# EAGLE design Tape_V2 (EAGLE 9.6.2)
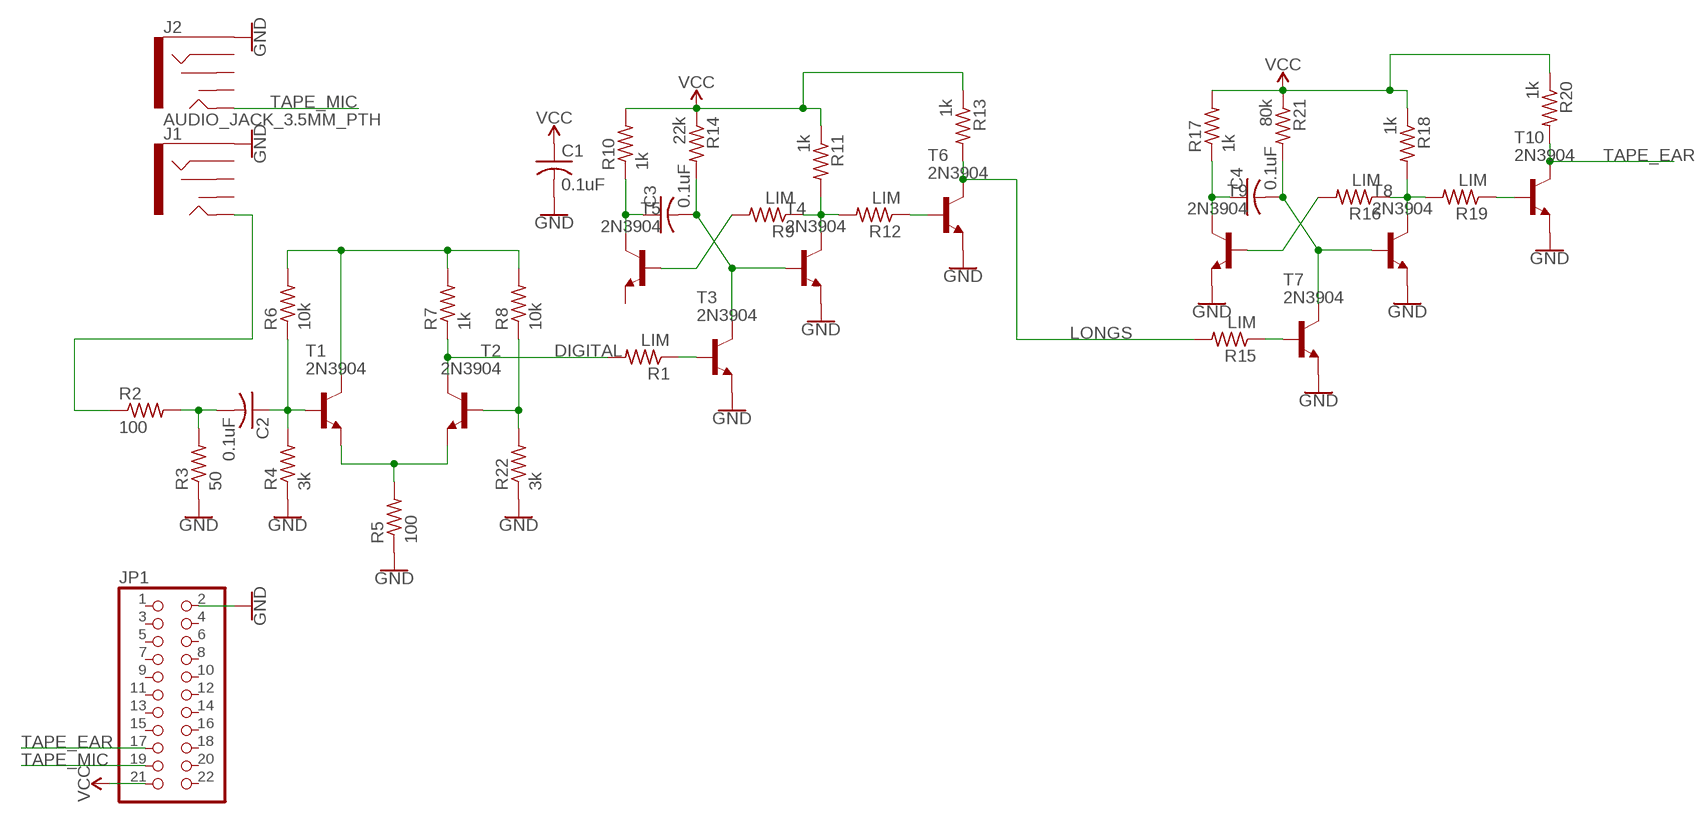
[diagram p0: schematic, sheet 1]

## Parts
C1  0.1uF  C-US025-030X050  [C025-030X050]
C2  0.1uF  C-US025-030X050  [C025-030X050]
C3  0.1uF  C-US025-030X050  [C025-030X050]
C4  0.1uF  C-US025-030X050  [C025-030X050]
J1  AUDIO_JACK_3.5MM_PTH  [AUDIO-JACK]
J2  AUDIO_JACK_3.5MM_PTH  [AUDIO-JACK]
JP1  PINHD-2X11/90  [2X11/90]
R1  LIM  R-US_0204/7  [0204/7]
R2  100  R-US_0204/7  [0204/7]
R3  50  R-US_0204/7  [0204/7]
R4  3k  R-US_0204/7  [0204/7]
R5  100  R-US_0204/7  [0204/7]
R6  10k  R-US_0204/7  [0204/7]
R7  1k  R-US_0204/7  [0204/7]
R8  10k  R-US_0204/7  [0204/7]
R9  LIM  R-US_0204/7  [0204/7]
R10  1k  R-US_0204/7  [0204/7]
R11  1k  R-US_0204/7  [0204/7]
R12  LIM  R-US_0204/7  [0204/7]
R13  1k  R-US_0204/7  [0204/7]
R14  22k  R-US_0204/7  [0204/7]
R15  LIM  R-US_0204/7  [0204/7]
R16  LIM  R-US_0204/7  [0204/7]
R17  1k  R-US_0204/7  [0204/7]
R18  1k  R-US_0204/7  [0204/7]
R19  LIM  R-US_0204/7  [0204/7]
R20  1k  R-US_0204/7  [0204/7]
R21  80k  R-US_0204/7  [0204/7]
R22  3k  R-US_0204/7  [0204/7]
T1  2N3904  [TO92]
T2  2N3904  [TO92]
T3  2N3904  [TO92]
T4  2N3904  [TO92]
T5  2N3904  [TO92]
T6  2N3904  [TO92]
T7  2N3904  [TO92]
T8  2N3904  [TO92]
T9  2N3904  [TO92]
T10  2N3904  [TO92]

## Nets
DIGITAL: R1.2 R7.1 T2.1(C)
GND: C1.2 J1.SLEEVE J2.SLEEVE JP1.2 R3.1 R4.1 R5.1 R22.1 T3.3(E) T4.3(E) T6.3(E) T7.3(E) T8.3(E) T9.3(E) T10.3(E)
LONGS: R13.2 R15.2 T6.1(C)
N$1: R5.2 T1.3(E) T2.3(E)
N$2: C2.1 R4.2 R6.1 T1.2(B)
N$3: C2.2 R2.2 R3.2
N$4: R6.2 R7.2 R8.2 T1.1(C)
N$5: R1.1 T3.2(B)
N$6: R8.1 R22.2 T2.2(B)
N$7: J1.TIP R2.1
N$8: C3.2 R14.2 T3.1(C) T4.2(B)
N$9: R9.2 T5.2(B)
N$10: C3.1 R10.1 T5.1(C)
N$12: R9.1 R11.2 R12.2 T4.1(C)
N$13: R12.1 T6.2(B)
N$16: R15.1 T7.2(B)
N$17: C4.2 R21.2 T7.1(C) T8.2(B)
N$18: R16.2 T9.2(B)
N$19: C4.1 R17.1 T9.1(C)
N$20: R16.1 R18.2 R19.2 T8.1(C)
N$21: R19.1 T10.2(B)
TAPE_EAR: JP1.17 R20.2 T10.1(C)
TAPE_MIC: J2.TIP JP1.19
VCC: C1.1 JP1.21 R10.2 R11.1 R13.1 R14.1 R17.2 R18.1 R20.1 R21.1
Unconnected: J1.RING J1.RSH J1.TSH J2.RING J2.RSH J2.TSH JP1.1 JP1.3 JP1.4 JP1.5 JP1.6 JP1.7 JP1.8 JP1.9 JP1.10 JP1.11 JP1.12 JP1.13 JP1.14 JP1.15 JP1.16 JP1.18 JP1.20 JP1.22 T5.3(E)

## Library data of the parts
C1-C4 = adafruit:C-US: CAPACITOR, American symbol
J1 J2 = SparkFun-Connectors:AUDIO_JACK_3.5MM: Audio Jack 3.5mm variants of PTH and SMT stereo audio jack with bypass switches. SparkFun Products: SparkFun SparkPunk Sound Kit <[https://www.sparkfun.com/products/11177]> - PTH MP3 Trigger <https://www.sparkfun.com/products/13720> -3.5mm SMD SparkFun PicoBoard <https://www.sparkfun.com/products/11888>- 2.5mm SMD; PROD_ID: CONN-08774; SF_ID: PRT-08032
JP1 = pinhead:PINHD-2X11: PIN HEADER
R1-R22 = adafruit:R-US_: RESISTOR, American symbol
T1-T10 = transistor:2N3904: NPN TRANSISTOR

## Board
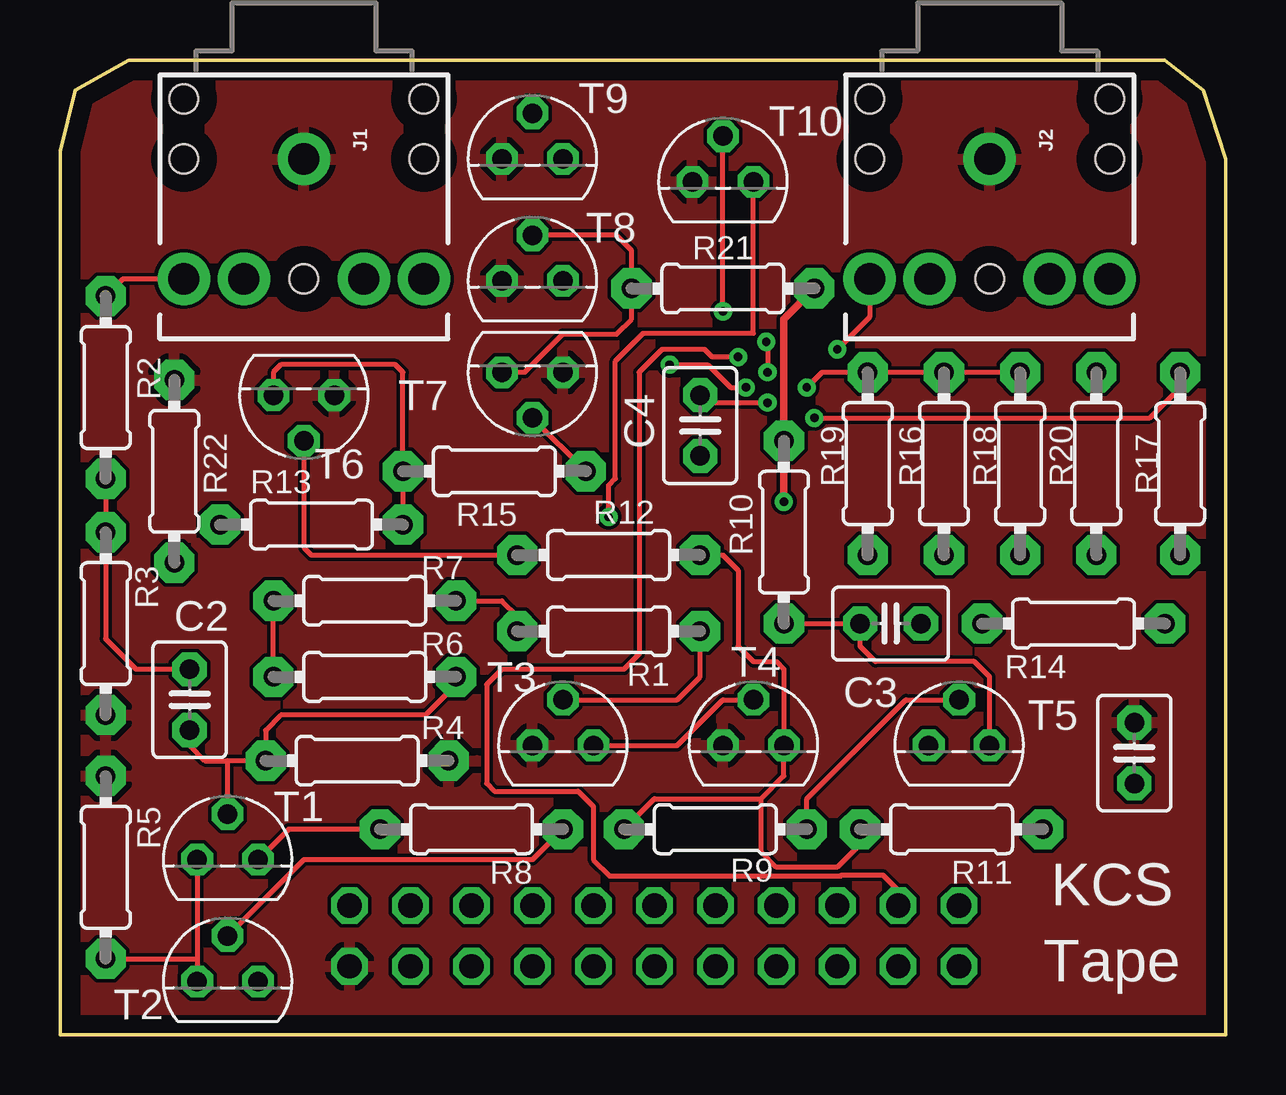
[diagram p1: board, top side]
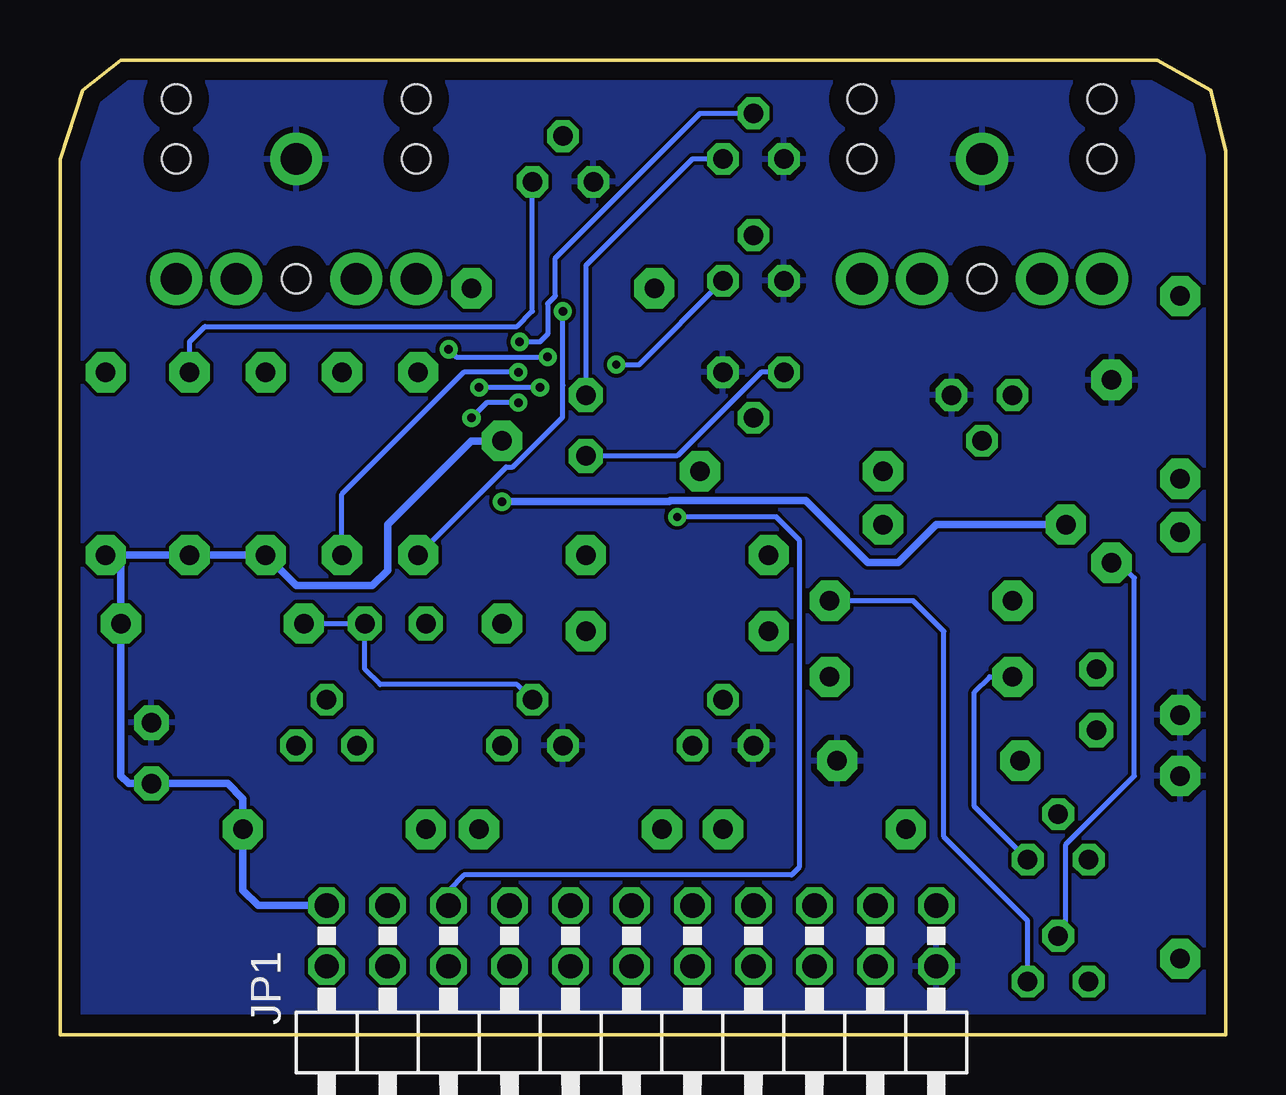
[diagram p2: board, bottom side, seen from below]

Size 48.58 x 40.64 mm. Coordinates in mm from the lower left corner, seen from the top.
Outline: 0.64,39.37 2.86,40.64 46.04,40.64 47.62,39.37 48.58,36.51 48.58,0 0,0 0,36.83 0.64,39.37
Copper layers (1*16): Top 0.035mm / dielectric 1.5mm / Bottom 0.035mm
Design rules "default *": minimum track width 8mil, minimum drill 0.35mm, track to track 6mil, track to pad 6mil, pad to pad 6mil, via to via 6mil, smd to smd 6mil, copper to edge 30mil, drill to drill 6mil, minimum pad ring 10mil, minimum via ring 8mil, stop-mask expansion 4mil, vias tented up to drill 0mil, thermal gap 10mil

### Footprints (pad centres in the part's own frame; a part is rotated, then mirrored left to right if it is on the bottom)
C025-030X050 = drill 0.813 pad 1.422 octagon: 1 -1.27,0; 2 1.27,0
AUDIO-JACK = drill 1.3 pad 2.184: RING 5,5; RSH 5,2.5; SLEEVE 0,0; TIP 5,-5; TSH 5,-2.5 | hole 1.2: 0,5; -2.5,5; -2.5,-5; 0,-5; 5,0
2X11/90 = drill 1.016 octagon: 1 -12.7,-6.35; 2 -12.7,-3.81; 3 -10.16,-6.35; 4 -10.16,-3.81; 5 -7.62,-6.35; 6 -7.62,-3.81; 7 -5.08,-6.35; 8 -5.08,-3.81; 9 -2.54,-6.35; 10 -2.54,-3.81; 11 0,-6.35; 12 0,-3.81; 13 2.54,-6.35; 14 2.54,-3.81; 15 5.08,-6.35; 16 5.08,-3.81; 17 7.62,-6.35; 18 7.62,-3.81; 19 10.16,-6.35; 20 10.16,-3.81; 21 12.7,-6.35; 22 12.7,-3.81
0204/7 = drill 0.813 pad 1.676 octagon: 1 -3.81,0; 2 3.81,0
TO92 = drill 0.813 octagon: 1 1.27,0; 2 0,1.905; 3 -1.27,0

### Placement (x,y rotation side)
C1  44.77,11.75 90 top
C2  5.4,13.97 90 top
C3  34.61,17.14 0 top
C4  26.67,25.4 270 top
J1  10.16,36.51 270 top
J2  38.73,36.51 270 top
JP1  24.77,-0.95 180 bottom
R1  22.86,16.83 180 top
R2  1.9,26.99 270 top
R3  1.9,17.14 90 top
R4  12.38,11.43 180 top
R5  1.9,6.98 270 top
R6  12.7,14.92 180 top
R7  12.7,18.1 180 top
R8  17.14,8.57 180 top
R9  27.3,8.57 0 top
R10  30.16,20.96 90 top
R11  37.15,8.57 180 top
R12  22.86,20 0 top
R13  10.48,21.27 0 top
R14  42.23,17.14 180 top
R15  18.1,23.5 180 top
R16  36.83,23.81 270 top
R17  46.67,23.81 270 top
R18  40.01,23.81 90 top
R19  33.66,23.81 90 top
R20  43.18,23.81 90 top
R21  27.62,31.12 180 top
R22  4.76,23.5 270 top
T1  6.98,7.3 0 top
T2  6.98,2.22 0 top
T3  20.96,12.06 0 top
T4  28.89,12.06 0 top
T5  37.47,12.06 0 top
T6  10.16,26.67 180 top
T7  19.68,27.62 180 top
T8  19.68,31.43 0 top
T9  19.68,36.51 0 top
T10  27.62,35.56 0 top

### Tracks (layer width: path | path; a pad name or v marks a point on that pad's centre or on a via)
DIGITAL
  Top 0.203: R7.1 18.41,18.1 19.05,17.46 R1.2
  Bottom 0.203: T2.1 8.26,4.76 11.75,8.26 11.75,16.83 13.02,18.1 R7.1
GND
  pour Top: -1.91,41.27 -1.91,-1.27 49.21,-1.27 49.21,41.27
  pour Bottom: -2.22,41.91 -2.22,-1.59 49.21,-1.59 49.53,-1.91 49.53,42.23 -1.91,42.23
LONGS
  Top 0.203: R13.2 R15.2 14.29,27.62 13.97,27.94 9.21,27.94 8.89,27.62 T6.1
N$1
  Top 0.203: T1.3 5.71,3.18 | 5.71,3.18 T2.3 | R5.2 5.71,3.18
N$2
  Top 0.203: 6.98,11.43 R4.2 8.57,12.7 9.21,13.34 15.24,13.34 16.51,14.61 R6.1 | T1.2 6.98,11.43 | 6.98,11.43 6.03,11.43 5.4,12.06 C2.1
N$3
  Top 0.203: R2.2 R3.2 1.9,16.51 3.18,15.24 C2.2
N$4
  Top 0.203: R6.2 R7.2 | R8.2 9.53,8.57 T1.1
  Bottom 0.203: T1.1 10.48,9.53 10.48,14.29 9.84,14.92 R6.2
N$5
  Top 0.203: T3.2 25.72,13.97 26.67,14.92 R1.1
N$6
  Top 0.203: R8.1 19.68,7.3 10.16,7.3 T2.2
  Bottom 0.203: T2.2 6.67,4.45 6.67,7.94 3.81,10.79 3.81,19.05 4.45,19.68 R22.2
N$7
  Top 0.203: J1.TIP 2.62,31.51 R2.1
N$8
  Top 0.203: T3.1 25.72,12.06 27.62,13.97 T4.2
  Bottom 0.203: T4.2 29.53,14.61 35.24,14.61 35.88,15.24 C3.2 R14.2
N$9
  Top 0.203: R9.2 31.12,9.84 35.24,13.97 T5.2
N$10
  Top 0.203: T5.1 38.73,14.92 38.1,15.56 33.97,15.56 33.34,16.19 C3.1 R10.1
N$12
  Top 0.203: R9.1 24.77,9.84 29.21,9.84 | 29.21,9.84 30.16,10.79 T4.1 30.16,15.24 29.84,15.56 28.89,15.56 28.26,16.19 28.26,19.37 27.62,20 R12.2 | R11.2 33.34,7.94 32.38,6.98 29.84,6.98 29.21,7.62 29.21,9.84
N$13
  Top 0.203: T6.2 10.16,20.32 10.48,20 R12.1
N$16
  Top 0.203: T7.2 R15.1
N$17
  Top 0.203: T7.1 19.37,27.62 20.96,29.21 23.18,29.21 23.81,29.84 R21.2 23.81,32.7 23.18,33.34 T8.2
  Bottom 0.203: T7.1 19.37,27.62 22.86,24.13 C4.2
N$18  (via drill 0.35)
  Top 0.203: v29.43,28.89 29.48,28.84 v29.48,27.62
  Bottom 0.203: R16.2 36.83,22.54 31.75,27.62 v29.48,27.62 | T9.2 21.91,38.42 27.94,32.38 27.94,30.8 28.26,30.48 28.26,29.21 28.58,28.89 v29.43,28.89
N$19  (via drill 0.35)
  Top 0.203: R17.1 46.67,26.99 45.4,25.72 v31.43,25.72 | C4.1 26.99,26.35 v29.48,26.35
  Bottom 0.203: T9.1 22.23,36.51 26.67,32.07 C4.1 | v29.48,26.35 30.8,26.35 v31.43,25.72
N$20  (via drill 0.35)
  Top 0.203: v25.4,27.94 26.99,27.94 27.94,26.99 v28.58,26.99 | R16.1 R18.2 R19.2 31.75,27.62 v31.12,26.99
  Bottom 0.203: v25.4,27.94 24.45,27.94 T8.1 | v28.58,26.99 v31.12,26.99
N$21  (via drill 0.35)
  Top 0.203: v27.62,30.16 T10.2
  Bottom 0.203: R19.1 29.98,23.67 29.71,23.67 27.64,25.75 27.64,27.07 27.62,27.08 v27.62,30.16
TAPE_EAR  (via drill 0.35)
  Top 0.203: v22.86,21.59 22.86,22.9 23.14,23.18 23.14,28.09 24.3,29.25 28.89,29.25 T10.1
  Bottom 0.203: R20.2 43.18,28.89 42.55,29.53 29.53,29.53 28.89,30.16 T10.1 | v22.86,21.59 18.73,21.59 17.78,20.64 17.78,6.98 18.1,6.67 31.75,6.67 32.38,6.03 JP1.17
TAPE_MIC  (via drill 0.35)
  Top 0.203: J2.TIP 33.73,29.92 v32.38,28.58 | v28.26,28.26 27.17,28.26 26.86,28.57 25.09,28.57 25.08,28.58 24.13,27.62 24.13,15.87 23.5,15.24 18.41,15.24 17.78,14.61 17.78,10.48 18.1,10.16 21.59,10.16 22.23,9.53 22.23,7.3 22.9,6.63 32.53,6.63 32.57,6.67 34.29,6.67 34.92,6.03 JP1.19
  Bottom 0.203: v32.38,28.58 32.07,28.26 v28.26,28.26
VCC  (via drill 0.35)
  Top 0.305: v30.16,22.23 R10.2 30.16,29.84 R21.1
  Bottom 0.305: JP1.21 40.32,5.4 40.96,6.03 R11.1 40.96,9.84 41.59,10.48 C1.1 45.72,10.48 46.04,10.79 R14.1 46.04,20 R17.2 R20.1 R18.1 38.73,18.73 35.56,18.73 34.92,19.37 34.92,21.27 31.43,24.77 R10.2 | R13.1 12.06,21.27 13.65,19.68 14.92,19.68 17.51,22.27 23.14,22.27 23.19,22.23 v30.16,22.23

### Text on the board
tPlace: KCS | Tape